# Altium project Voltage_Regulator.PrjPcb
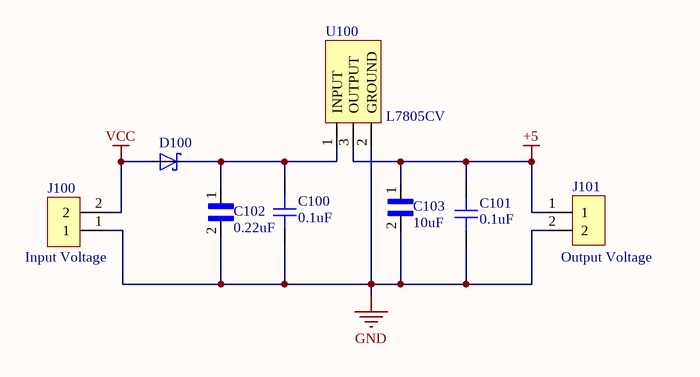
[diagram p0: Sheet1.SchDoc]
1 sheet, 8 parts. Net scope: global (net labels, ports and power ports of the same name join across sheets).
Board file: PCB1.PcbDoc

## Sheet Sheet1.SchDoc
size A4; SheetNumber: 1; SheetTotal: 1

### Parts
C100  0.1uF  [CAP_0603]
C101  0.1uF  [CAP_0603]
C102  0.22uF  [CAP-1210-X7R-10uF]
C103  10uF  [CAP-1210-X7R-10uF]
D100  1PS79SB70  [DIODE_SCHOTTKY]  (value not drawn)
J100  Input Voltage  [HEADER_2]
J101  Output Voltage  [HEADER_2]
U100  L7805CV  [L7805CV]

### Nets
+5: C101.2 C103.1 J101.1 U100.3(OUTPUT)
GND: C100.1 C101.1 C102.2 C103.2 J100.1 J101.2 U100.2(GROUND)
VCC: D100.2(A) J100.2
NetC100_2: C100.2 C102.1 D100.1(K) U100.1(INPUT)

### Library data of the parts
C100 C101 = CAP_0603_25V: Capacitor SMD 0603 25V
C102 C103 = CAP-1210-X7R-10uF: CAP CER 10UF 25V X7R 1210 / Cap Ceramic 10uF 25V X7R 10% Pad SMD 1210 125¡ãC T/R; Manufacturer: Samsung; Manufacturer Part Number: CL32B106KAJNNNE; Supplier 1: RSComponents; RoHS: Yes; Category: Ceramic Capacitors; Stock 1: 53000; Pricing 1: 1000=0,10400, 2000=0,09700, 5000=0,08800, 10000=0,08400, 25000=0,07900 (GBP); Mount: Surface Mount; Case/Package: 1210; Contact Plating: Tin; Case Code (Imperial): 1210; Case Code (Metric): 3225; Material: Ceramic; Min Operating Temperature: -55°C; Max Operating Temperature: 125°C; Capacitance: 10uF; Tolerance: 10%; Package Quantity: 1000; Packaging: Tape and Reel; Voltage Rating: 25V; Voltage: 25V; Dielectric: X7R; Length: 3.2mm; Width: 0.098inch; Height: 2.5mm; Thickness: 0.106inch; Depth: 2.5mm; Radiation Hardening: No; ComponentLink1URL: https://datasheet.ciiva.com/25791/cl32b106kajnnne-25791845.pdf?src-supplier=Digi-Key; ComponentLink1Description: https://datasheet.ciiva.com/25791/cl32b106kajnnne-25791845.pdf?src-supplier=Digi-Key; ComponentLink2URL: https://datasheet.ciiva.com/16437/cl32b106kajnnne-16437180.pdf?src-supplier=Future+Electronics; ComponentLink2Description: https://datasheet.ciiva.com/16437/cl32b106kajnnne-16437180.pdf?src-supplier=Future+Electronics; ComponentLink3URL: https://datasheet.ciiva.com/29202/450857-da-01-en-vs-kondensator-1210-29202679.pdf?src-supplier=Conrad; ComponentLink3Description: https://datasheet.ciiva.com/29202/450857-da-01-en-vs-kondensator-1210-29202679.pdf?src-supplier=Conrad; Supplier Part Number 1: 7661854
D100 = Schottky_Diode
J100 J101 = Terminal_Block_2